# EAGLE design CAN-Adapter_3.2korr_0622 (EAGLE 6.1)
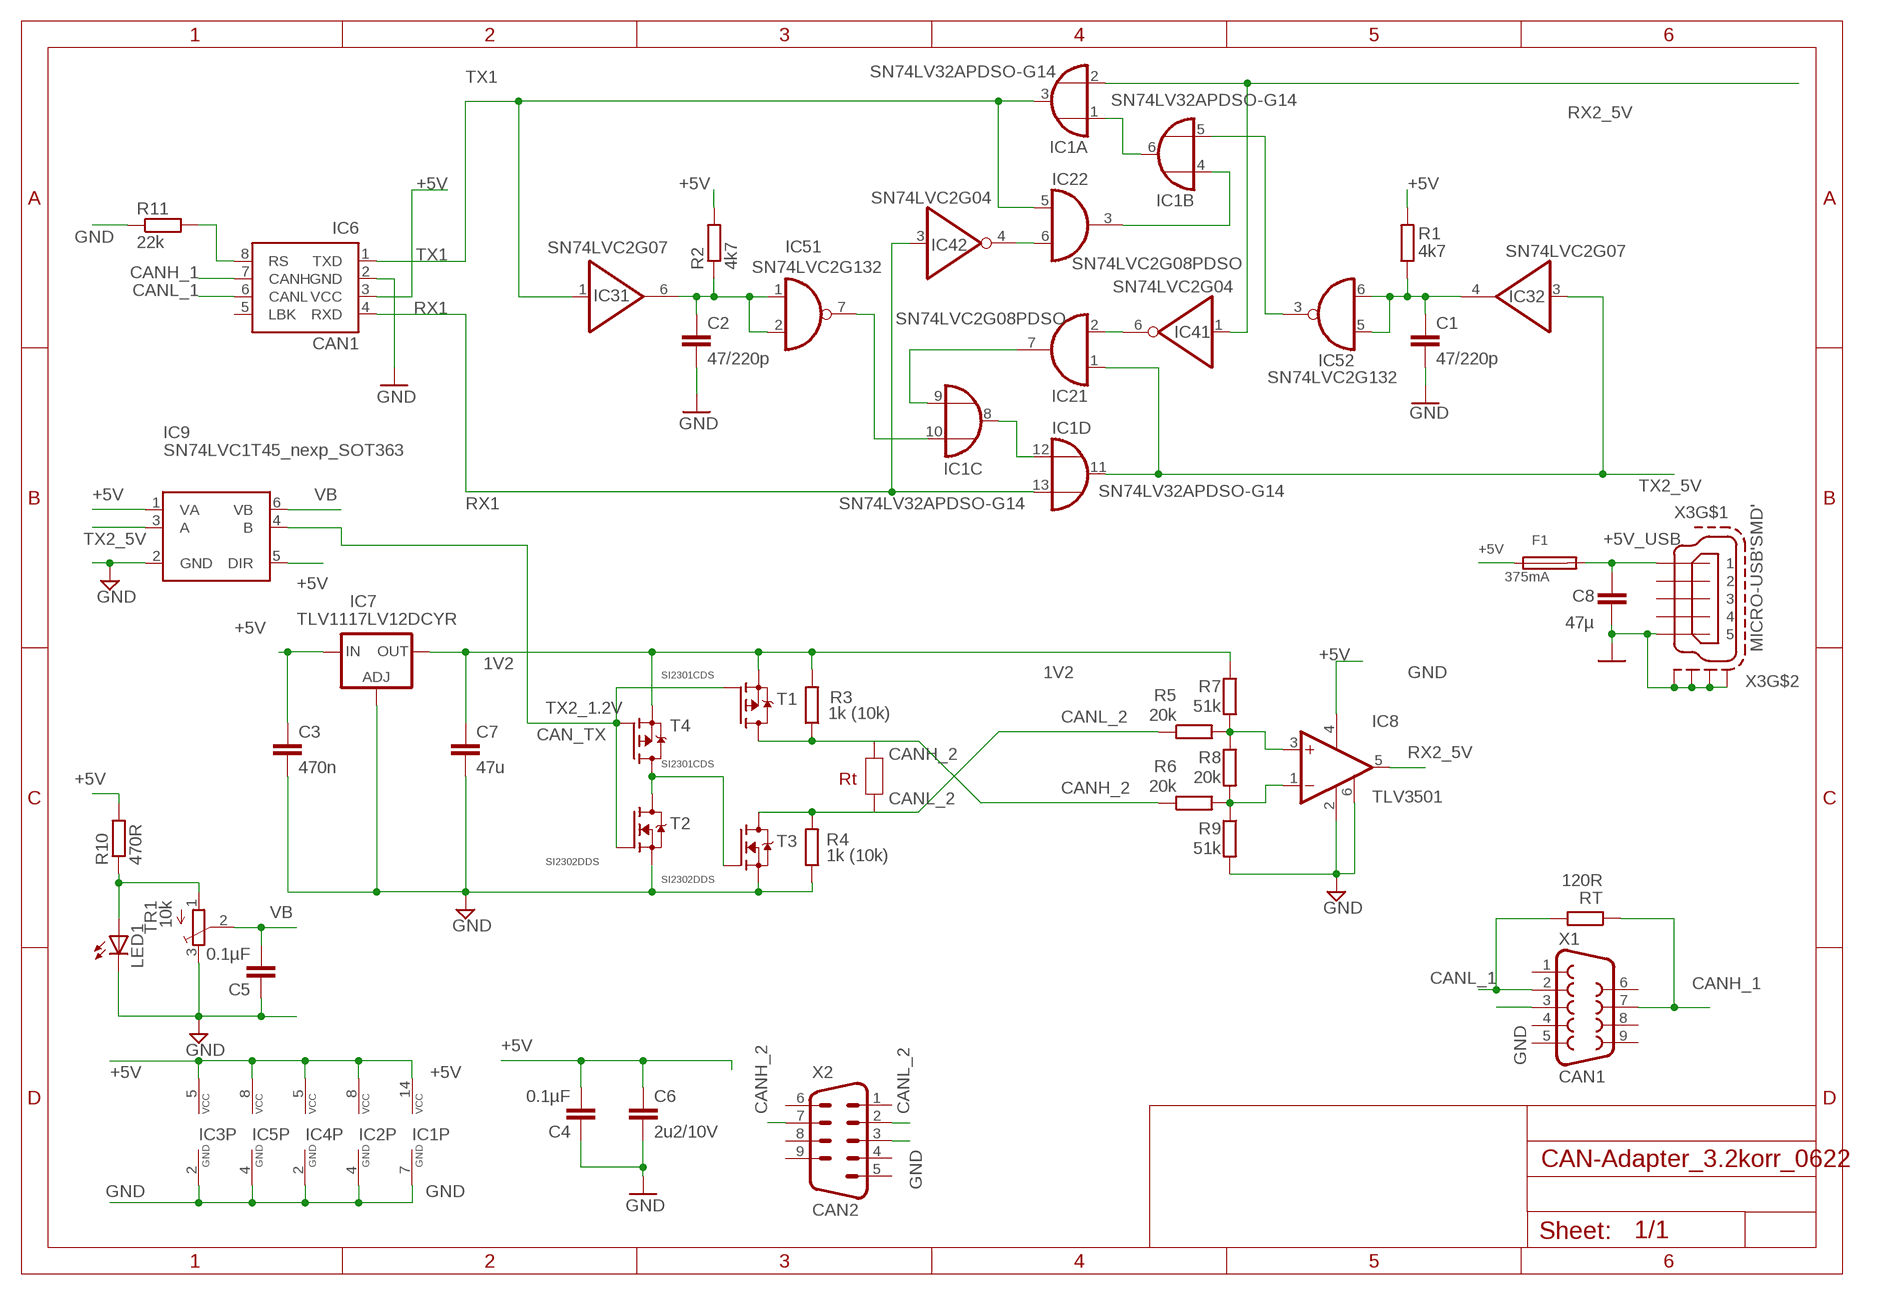
[diagram p0: schematic, sheet 1]

## Parts
C1  47/220p  C-EUC0603  [C0603]
C2  47/220p  C-EUC0603  [C0603]
C3  470n  C-EUC1206S  [C1206S]
C4  0.1µF  C-EUC0805  [C0805]
C5  0.1µF  C-EUC0805  [C0805]
C6  2u2/10V  C-EUC0805  [C0805]
C7  47u  C-EUC1206K  [C1206K]
C8  47µ  C-EUC1206K  [C1206K]
F1  375mA  SMD-FUSE1206  [1206]
IC1  SN74LV32APDSO-G14  [PW_R-PDSO-G14]
IC2  SN74LVC2G08PDSO  [R-PDSO-G08_DCT]
IC3  SN74LVC2G07  SN74LVC2G07DCK  [R-PDSO-G06]
IC4  SN74LVC2G04  SN74LVC2G04DCK  [R-PDSO-G06]
IC5  SN74LVC2G132  SN74LVC2G132DCU  [S-PDSO-G08_DCU]
IC6  CAN1  SN65233SO-08''  [SO-08]
IC7  TLV1117LV12DCYR  LD117AS12TR  [SOT223]
IC8  TLV3501  [SOT23-6]
IC9  SN74LVC1T45_nexp_SOT363  SN74AVCH1T45SOT363  [SOT363]
LED1  LED3MM  [LED3MM]
R1  4k7  R-EU_R0603  [R0603]
R2  4k7  R-EU_R0603  [R0603]
R3  1k (10k)  R-EU_R0603  [R0603]
R4  1k (10k)  R-EU_R0603  [R0603]
R5  20k  R-EU_R0603  [R0603]
R6  20k  R-EU_R0603  [R0603]
R7  51k  R-EU_R0603  [R0603]
R8  20k  R-EU_R0603  [R0603]
R9  51k  R-EU_R0603  [R0603]
R10  470R  R-EU_R0603  [R0603]
R11  22k  R-EU_R0603  [R0603]
RT  120R  R-EU_R0603  [R0603]
T1  SI2301CDS  SI2301CDS_PMOS  [SOT23]
T2  SI2302DDS  SI2302DDS_NMOS  [SOT23]
T3  SI2302DDS  SI2302DDS_NMOS  [SOT23]
T4  SI2301CDS  SI2301CDS_PMOS  [SOT23]
TR1  10k  TRIM_EU-TC33X-2  [TC33X-2]
X1  CAN1  F09D  [F09D]
X2  CAN2  M09D  [M09D]
X3  MICRO-USB'SMD'  [MICRO-USB_SMD]

## Nets
1V2: C7.1 IC7.4(OUT) R3.2 R7.1 T1.2(S) T4.2(S)
+5V: C3.1 C4.2 C6.1 F1.P$1 IC1.14(P:VCC) IC2.8(P:VCC) IC3.5(P:VCC) IC4.5(P:VCC) IC5.8(P:VCC) IC6.3(VCC) IC7.3(IN) IC8.4(V+) IC9.1(VA) IC9.5(DIR) R1.2 R2.2 R10.2
+5V_USB: C8.1 F1.P$2 X3.P$1
CANH_1: IC6.7(CANH) RT.1 X1.7
CANH_2: R3.1 R6.1 T1.3(D) X2.7
CANL_1: IC6.6(CANL) RT.2 X1.2
CANL_2: R4.2 R5.1 T3.3(D) X2.2
GND: C1.2 C2.2 C3.2 C4.1 C5.1 C6.2 C7.2 C8.2 IC1.7(P:GND) IC2.4(P:GND) IC3.2(P:GND) IC4.2(P:GND) IC5.4(P:GND) IC6.2(GND) IC7.1(ADJ) IC8.2(V-) IC8.6(SHDN) IC9.2(GND) LED1.K(C) R4.1 R9.2 R11.1 T2.2(S) T3.2(S) TR1.3(E) X1.3 X2.3 X3.P$5 X3.P$6(S1) X3.P$7(S2) X3.P$8(S3) X3.P$9(S4)
IC1,6: IC1.1(A:I0) IC1.6(B:O)
IC1,8: IC1.8(C:O) IC1.12(D:I0)
IC2,3: IC1.4(B:I0) IC2.3(2:Y)
IC2,7: IC1.9(C:I0) IC2.7(1:Y)
IC3,4: C1.1 IC3.4(2:Y) IC5.5(2:A) IC5.6(2:B) R1.1
IC3,6: C2.1 IC3.6(1:Y) IC5.1(1:A) IC5.2(1:B) R2.1
IC4,4: IC2.6(2:B) IC4.4(2:Y)
IC4,6: IC2.2(1:B) IC4.6(1:Y)
IC5,3: IC1.5(B:I1) IC5.3(2:Y)
IC5,7: IC1.10(C:I1) IC5.7(1:Y)
N$9: T2.3(D) T3.1(G) T4.3(D)
N$12: LED1.A R10.1 TR1.1(A)
N$18: IC6.8(RS) R11.2
N$23: IC8.3(+IN) R5.2 R7.2 R8.1
N$24: IC8.1(-IN) R6.2 R8.2 R9.1
RX1: IC1.13(D:I1) IC4.3(2:A) IC6.4(RXD)
RX2_5V: IC1.2(A:I1) IC4.1(1:A) IC8.5(OUT)
TX1: IC1.3(A:O) IC2.5(2:A) IC3.1(1:A) IC6.1(TXD)
TX2_1.2V: IC9.4(B) T1.1(G) T2.1(G) T4.1(G)
TX2_5V: IC1.11(D:O) IC2.1(1:A) IC3.3(2:A) IC9.3(A)
VB: C5.2 IC9.6(VB) TR1.2(S)
Unconnected: IC6.5(LBK) X1.1 X1.4 X1.5 X1.6 X1.8 X1.9 X2.1 X2.4 X2.5 X2.6 X2.8 X2.9 X3.P$2 X3.P$3 X3.P$4

## Notes on the sheet
- SN74LVC2G08PDSO
- SN74LVC2G08PDSO
- CAN_TX
- Rt

## Library data of the parts
C1-C8 = rcl:C-EU: CAPACITOR, European symbol
F1 = fuse:SMD-FUSE
IC1 = texas:SN74LV32A: SN74LV32A Quadruple 2-Input Positive-Or Gates
IC2 = texas:SN74LVC2G08: SN74LVC2G08 Dual 2-Input Positive-AND Gate
IC3 = texas:SN74LVC2G07: SN74LVC2G07 Dual Buffer and Driver With Open-Drain Outputs
IC4 = texas:SN74LVC2G04: SN74LVC2G04 Dual Inverter Gate
IC5 = texas:SN74LVC2G132: Dual 2-Input NAND Gate With Schmitt-Trigger Inputs
IC6 = texas:SN65233: 3,3V CAN Transeiver
IC7 = v-reg:LD117A?*: Low drop fixed and adjustable positive voltage regulators 1 A Source: http://www.st.com/stonline/products/literature/ds/7194/ld1117axx.pdf
IC8 = texas:TLV3501
IC9 = texas:SN74AVCH1T45
LED1 = led:LED: LED OSRAM: - CHIPLED LG R971, LG N971, LY N971, LG Q971, LY Q971, LO R971, LY R971 LH N974, LH R974 LS Q976, LO Q976, LY Q976 LO Q996 - Hyper CHIPLED LW Q18S LB Q993, LB Q99A, LB R99A - SideLED LS A670, LO A670, LY A670, LG A670, LP A670 LB A673, LV A673, LT A673, LW A673 LH A674 LY A675 LS A676, LA A676, LO A676, LY A676, LW A676 LS A679, LY A679, LG A679 - Hyper Micro SIDELED® LS Y876, LA Y876, LO Y876, LY Y876 LT Y87S - SmartLED LW L88C, LW L88S LB L89C, LB L89S, LG L890 LS L89K, LO L89K, LY L89K LS L896, LA L896, LO L896, LY L896 - TOPLED LS T670, LO T670, LY T670, LG T670, LP T670 LSG T670, LSP T670, LSY T670, LOP T670, LYG T670 LG T671, LOG T671, LSG T671 LB T673, LV T673, LT T673, LW T673 LH T674 LS T676, LA T676, LO T676, LY T676, LB T676, LH T676, LSB T676, LW T676 LB T67C, LV T67C, LT T67C, LS T67K, LO T67K, LY T67K, LW E67C LS E67B, LA E67B, LO E67B, LY E67B, LB E67C, LV E67C, LT E67C LW T67C LS T679, LY T679, LG T679 LS T770, LO T770, LY T770, LG T770, LP T770 LB T773, LV T773, LT T773, LW T773 LH T774 LS E675, LA E675, LY E675, LS T675 LS T776, LA T776, LO T776, LY T776, LB T776 LHGB T686 LT T68C, LB T68C - Hyper Mini TOPLED® LB M676 - Mini TOPLED Santana® LG M470 LS M47K, LO M47K, LY M47K Source: http://www.osram.convergy.de LUXEON: - LUMILED® LXK2-PW12-R00, LXK2-PW12-S00, LXK2-PW14-U00, LXK2-PW14-V00 LXK2-PM12-R00, LXK2-PM12-S00, LXK2-PM14-U00 LXK2-PE12-Q00, LXK2-PE12-R00, LXK2-PE12-S00, LXK2-PE14-T00, LXK2-PE14-U00 LXK2-PB12-K00, LXK2-PB12-L00, LXK2-PB12-M00, LXK2-PB14-N00, LXK2-PB14-P00, LXK2-PB14-Q00 LXK2-PR12-L00, LXK2-PR12-M00, LXK2-PR14-Q00, LXK2-PR14-R00 LXK2-PD12-Q00, LXK2-PD12-R00, LXK2-PD12-S00 LXK2-PH12-R00, LXK2-PH12-S00 LXK2-PL12-P00, LXK2-PL12-Q00, LXK2-PL12-R00 Source: www.luxeon.com KINGBRIGHT: KA-3528ASYC Source: www.kingbright.com
R1-R11 RT = rcl:R-EU_: RESISTOR, European symbol
T1 T4 = transistor-fet:SI2301CDS_PMOS: P-MOSFET low Uth
T2 T3 = transistor-fet:SI2302DDS_NMOS: N-MOSFET, low Uth
TR1 = pot:TRIM_EU-: POTENTIOMETER
X1 = con-subd:F09: SUB-D; OC_FARNELL: unknown; OC_NEWARK: unknown
X2 = con-subd:M09: SUB-D; OC_FARNELL: unknown; OC_NEWARK: unknown
X3 = Connectors:MICRO-USB

## Board
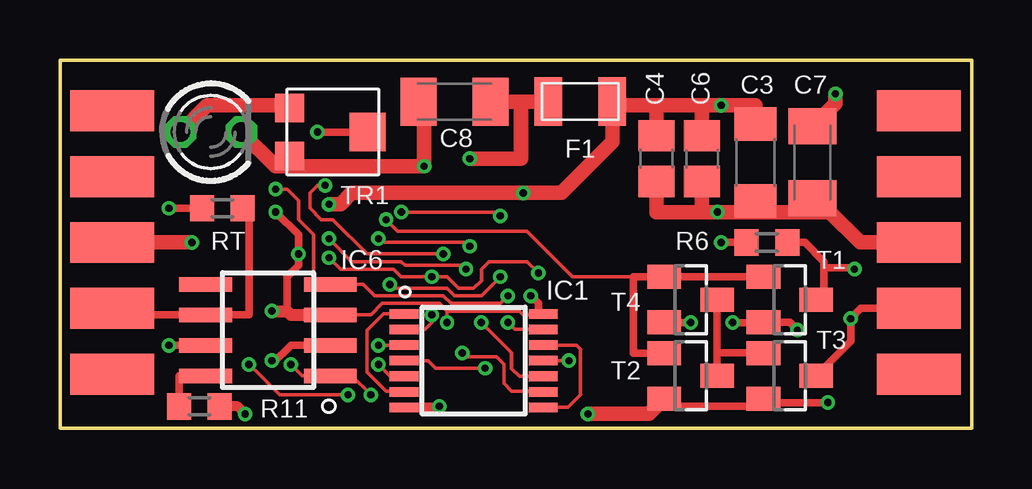
[diagram p1: board, top side]
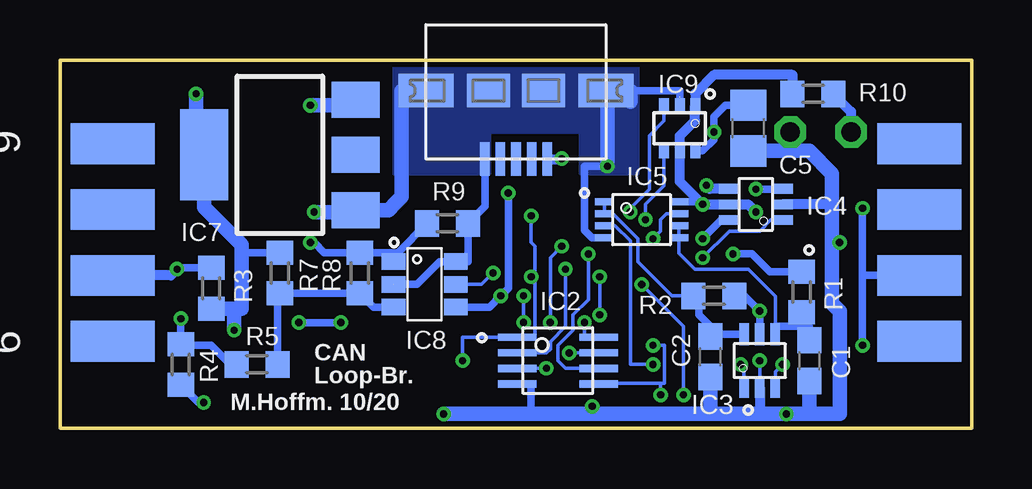
[diagram p2: board, bottom side, seen from below]

Size 38 x 15.34 mm. Coordinates in mm from the lower left corner, seen from the top.
Outline: 0,15.34 0,0 38,0 38,15.34 0,15.34
Copper layers (1*16): Top 0.035mm / dielectric 1.5mm / Bottom 0.035mm
Design rules: minimum track width 0.1mm, minimum drill 0.2mm, track to track 0.1mm, track to pad 0.1mm, pad to pad 0.1mm, via to via 0.1mm, smd to smd 0.1mm, copper to edge 0.2mm, drill to drill 0.21mm, minimum pad ring 0.25mm, minimum via ring 0.15mm, stop-mask expansion 0mil, vias tented up to drill 0mil, thermal gap 10mil

### Footprints (pad centres in the part's own frame; a part is rotated, then mirrored left to right if it is on the bottom)
C0603 = smd 1.1 x 1: 1 -0.85,0; 2 0.85,0
C1206S = smd 1.397 x 1.753: 1 -1.6,0; 2 1.6,0
C0805 = smd 1.3 x 1.5: 1 -0.95,0; 2 0.95,0
C1206K = smd 1.5 x 2: 1 -1.5,0; 2 1.5,0
1206 = smd 1.143 x 2.032: P$1 -1.333,0; P$2 1.333,0
PW_R-PDSO-G14 = smd 0.4 x 1.2: 1 -1.95,-2.9; 2 -1.3,-2.9; 3 -0.65,-2.9; 4 0,-2.9; 5 0.65,-2.9; 6 1.3,-2.9; 7 1.95,-2.9; 8 1.95,2.9; 9 1.3,2.9; 10 0.65,2.9; 11 0,2.9; 12 -0.65,2.9; 13 -1.3,2.9; 14 -1.95,2.9
R-PDSO-G08_DCT = smd 0.3 x 1.6: 1 -0.975,-1.7; 2 -0.325,-1.7; 3 0.325,-1.7; 4 0.975,-1.7; 5 0.975,1.7; 6 0.325,1.7; 7 -0.325,1.7; 8 -0.975,1.7
R-PDSO-G06 = smd 0.4 x 0.9: 1 -0.65,-1.1; 2 0,-1.1; 3 0.65,-1.1; 4 0.65,1.1; 5 0,1.1; 6 -0.65,1.1
S-PDSO-G08_DCU = smd 0.3 x 0.8: 1 -0.75,-1.55; 2 -0.25,-1.55; 3 0.25,-1.55; 4 0.75,-1.55; 5 0.75,1.55; 6 0.25,1.55; 7 -0.25,1.55; 8 -0.75,1.55
SO-08 = smd 0.6 x 2.2: 1 -1.905,-2.6; 2 -0.635,-2.6; 3 0.635,-2.6; 4 1.905,-2.6; 5 1.905,2.6; 6 0.635,2.6; 7 -0.635,2.6; 8 -1.905,2.6
SOT223 = smd 1.5 x 2: 1 -2.3,-3.15; 2 0,-3.15; 3 2.3,-3.15 | smd 3.8 x 2: 4 0,3.15
SOT23-6 = smd 0.69 x 0.99: 1 -0.95,-1.29; 2 0,-1.29; 3 0.95,-1.29; 4 0.95,1.3; 5 0.003,1.3; 6 -0.95,1.3
SOT363 = smd 0.42 x 0.6: 1 -0.65,-0.95; 2 0,-0.95; 3 0.65,-0.95; 4 0.65,0.95; 5 0,0.95; 6 -0.65,0.95
LED3MM = drill 0.813 octagon: A -1.27,0; K 1.27,0
R0603 = smd 1 x 1.1: 1 -0.85,0; 2 0.85,0
SOT23 = smd 1 x 1.4: 1 -0.95,-1.1; 2 0.95,-1.1; 3 0,1.1
TC33X-2 = smd 1.2 x 1.2: 1 -1,-1.8; 3 1,-1.8 | smd 1.6 x 1.5: 2 0,1.45
F09D = smd 1.7 x 3.5: 1 -5.486,-6.045; 2 -2.743,-6.045; 3 0,-6.045; 4 2.743,-6.045; 5 5.486,-6.045 | smd 1.7 x 3.5 bottom: 6 -4.115,-6.045; 7 -1.372,-6.045; 8 1.372,-6.045; 9 4.115,-6.045
M09D = smd 1.7 x 3.5: 1 5.486,-6.045; 2 2.743,-6.045; 3 0,-6.045; 4 -2.743,-6.045; 5 -5.486,-6.045 | smd 1.7 x 3.5 bottom: 6 4.115,-6.045; 7 1.372,-6.045; 8 -1.372,-6.045; 9 -4.115,-6.045
MICRO-USB_SMD = smd 0.4 x 1.4: P$1 -1.3,4.3; P$2 -0.65,4.3; P$3 0,4.3; P$4 0.65,4.3; P$5 1.3,4.3 | smd 2.3 x 1.4: P$6 -3.75,1.45; P$9 3.75,1.45 | smd 1.8 x 1.4: P$7 -1.15,1.45; P$8 1.15,1.45

### Placement (x,y rotation side)
C1  6.77,2.82 270 bottom
C2  10.89,2.98 270 bottom
C3  28.99,11.07 270 top
C4  24.86,11.23 90 top
C5  9.31,12.5 90 bottom
C6  26.77,11.23 270 top
C7  31.37,11.07 270 top
C8  16.45,13.61 180 top
F1  21.69,13.61 180 top
IC1  17.25,2.82 270 top
IC2  17.25,2.82 270 bottom
IC3  8.83,2.82 0 bottom
IC4  8.99,9.33 90 bottom
IC5  13.75,8.69 270 bottom
IC6  8.67,4.09 90 top
IC7  28.83,11.39 90 bottom
IC8  22.8,5.99 270 bottom
IC9  12.17,12.5 180 bottom
LED1  6.29,12.34 0 top
R1  7.08,5.67 90 bottom
R2  10.74,5.52 0 bottom
R3  31.69,5.83 270 bottom
R4  32.96,2.66 90 bottom
R5  29.79,2.66 0 bottom
R6  29.47,7.74 180 top
R7  28.83,6.47 270 bottom
R8  25.5,6.47 90 bottom
R9  21.85,8.53 0 bottom
R10  6.61,13.93 180 bottom
R11  5.82,0.91 180 top
RT  6.77,9.17 0 top
T1  30.42,5.36 270 top
T2  26.29,2.18 270 top
T3  30.42,2.18 270 top
T4  26.29,5.36 270 top
TR1  11.37,12.34 270 top
X1  -3.87,7.74 90 top
X2  41.85,7.74 270 top
X3  18.99,15.52 180 bottom

### Tracks (layer width: path | path; a pad name or v marks a point on that pad's centre or on a via)
1V2  (via drill 0.3)
  Top 0.305: v28.04,4.4 T1.2 30.42,4.41 v30.74,4.09 | T4.2 v26.29,4.4
  Top 0.61: 32.33,13.68 v32.33,13.93 32.33,13.52 C7.1
  Bottom 0.305: v26.29,4.4 v28.04,4.4 | 30.42,7.32 R7.1 | R3.2 31.64,4.98
  Bottom 0.61: v32.33,13.93 32.33,11.86 32.01,11.86 32.01,11.68 31.69,11.68 IC7.4 31.98,9.2 30.42,7.63 30.42,7.32 30.42,4.98 30.74,4.98 | 31.64,4.98 30.74,4.98 | v30.74,4.09 30.74,4.98
+5V  (via drill 0.3)
  Top 0.152: 16.13,4.88 19.15,4.88 19.31,4.72 19.94,4.72 20.15,4.72 IC1.14 | 16.13,4.88 15.82,5.2 13.44,5.2 12.96,4.72 IC6.3 | 16.13,4.88 v16.13,4.4
  Top 0.305: v19.63,5.51 19.94,5.2 19.94,4.72 | v8.99,9.01 9.94,8.05 v9.94,7.26 9.94,6.78 9.47,6.31 9.47,4.88
  Top 0.508: v8.83,4.88 9.47,4.88 9.63,4.72 IC6.3
  Top 0.61: v11.21,9.32 11.69,9.32 12.17,9.8 v19.31,9.8 20.9,9.8 23.02,11.93 F1.P$1 23.02,13.45 24.87,13.45 | C3.1 28.99,13.45 v27.56,13.45 26.77,13.45 | C6.1 26.77,13.45 | C4.2 24.87,13.45 | 24.87,13.45 26.77,13.45
  Bottom 0.152: IC2.8 16.13,3.79 v16.13,4.4
  Bottom 0.305: R2.2 9.47,5.51 v8.83,4.88 IC3.5 | 11.53,13.43 IC9.1 | v19.31,9.8 19.31,5.83 v19.63,5.51 20.1,5.04 IC8.4 | 12.17,9.44 IC5.8 11.33,9.44 v11.21,9.32 | v9.94,7.26 9.15,7.26 8.41,6.52 R1.2
  Bottom 0.406: 11.53,13.43 11.53,12.82 12.17,12.18 IC9.5 12.17,10.28 v11.21,9.32 IC4.5 9.31,9.32 v8.99,9.01 | IC9.1 11.52,13.94 10.74,14.72 7.46,14.72 R10.2
  Bottom 0.61: IC7.3 25.68,13.61 25.84,13.45 v27.56,13.45
+5V_USB  (via drill 0.3)
  Top 0.406: 19.22,13.54 19.15,13.61
  Top 0.61: v17.09,11.23 19.22,11.23 19.22,13.54 | 19.15,13.61 C8.1 F1.P$2
  Bottom 0.406: X3.P$1 17.09,11.22 v17.09,11.23
CANH_1  (via drill 0.3)
  Top 0.305: IC6.7 v4.55,3.45 | RT.1 v4.55,9.17
  Bottom 0.305: 4.55,6.37 X1.7 | v4.55,3.45 4.55,6.37 | 4.55,6.37 v4.55,9.17
CANH_2  (via drill 0.3)
  Top 0.305: 30.48,7.58 R6.1 31.06,7.74 31.85,6.94 | 31.84,6.94 31.85,6.94 | 31.85,6.94 31.85,6.69 | 31.85,6.69 31.85,5.36 T1.3 | 31.85,6.69 33.05,6.69 v33.12,6.63
  Bottom 0.305: 35.81,6.31 X2.7 | R3.1 33.06,6.68 v33.12,6.63
  Bottom 0.406: v33.12,6.63 33.38,6.37 X2.7
  Bottom 0.508: X2.7 35.82,6.37
CANL_1
  Top 0.152: X1.2 2.18,5.2
  Top 0.305: X1.2 2.18,4.72 IC6.6 7.88,4.72 7.88,9.17 RT.2
CANL_2  (via drill 0.3)
  Top 0.305: T3.3 32.96,3.62 v32.96,4.56 33.39,4.99 X2.2
  Bottom 0.305: v32.96,4.56 R4.2 32.96,3.45 31.69,3.45 30.9,2.66 R5.1
GND  (via drill 0.3)
  Top 0.152: IC1.7 14.39,0.91
  Top 0.305: X2.3 35.34,7.74 | v8.83,2.82 8.83,2.66 9.63,3.45 IC6.2 | 6.67,0.75 R11.1 | T2.2 25.19,0.91 29.32,0.91 T3.2 29.32,1.07 v32.01,1.07
  Top 0.406: v7.72,0.59 7.4,0.91 R11.1 | IC1.7 15.82,0.87 v15.82,0.91
  Top 0.61: v22.01,0.59 24.55,0.59 T2.2 | 9.57,10.91 v15.18,10.91 15.18,13.61 C8.2 | 26.77,8.99 27.41,8.99 v27.41,9.01 28.99,9.01 | 26.77,8.99 C6.2 | X2.3 33.37,7.74 32.1,9.01 31.37,9.01 | 9.57,10.91 TR1.3 | 9.57,10.91 8.99,10.91 LED1.K | 26.77,8.99 24.87,8.99 C4.1 | C3.2 28.99,9.01 | C7.2 31.37,9.01 | 31.37,9.01 28.99,9.01 | X1.3 v5.5,7.74
  Bottom 0.152: IC2.4 18.99,1.84 | v8.83,2.82 IC3.2 | 23.97,9.38 23.99,9.4
  Bottom 0.305: IC5.4 15.82,7.94 16.13,8.26 16.13,10.91 v15.18,10.91 | IC2.4 18.36,1.84 18.36,0.59 | IC9.2 12.17,14.07 14.71,14.07 | IC8.2 23.12,5.99 22.17,6.94 IC8.6 21,6.94 R9.2 20.29,9.24 X3.P$5 | v32.01,1.07 32.22,1.07 R4.1
  Bottom 0.406: 5.82,9.32 IC4.2 | IC3.2 8.83,0.59 | v15.82,0.91 15.82,0.59
  Bottom 0.61: 5.82,7.74 5.82,9.32 5.82,10.59 6.77,11.55 7.56,11.55 | v5.5,7.74 5.82,7.74 | 5.82,7.74 5.82,5.2 5.5,4.88 5.5,0.59 6.77,0.59 | 6.77,0.59 v7.72,0.59 8.83,0.59 10.9,0.59 | C1.2 6.77,0.59 | 10.9,0.59 15.82,0.59 18.36,0.59 v22.01,0.59 | 10.9,0.59 C2.2 10.9,1.86 | 14.23,13.61 14.23,14.07 14.71,14.07 X3.P$6 15.18,14.07 v15.18,10.91 | 22.64,13.97 X3.P$9 23.75,14.07 23.75,9.64 23.99,9.4 24.31,9.09 IC7.1 25.68,9.01 v27.41,9.01 | C5.1 7.56,11.55 | 7.56,11.55 LED1.K
  pour Bottom (no thermals): 13.91,15.04 24.07,15.04 24.07,10.6 20.1,10.6 20.1,12.34 16.29,12.34 16.29,10.6 13.91,10.6
IC1,6
  Top 0.152: IC1.6 14.35,1.55 13.59,1.55 12.8,2.34 12.8,4.09 13.48,4.77 IC1.1 14.23,4.77
IC1,8
  Top 0.152: IC1.12 20.13,3.45 21.53,3.45 21.69,3.29 21.69,1.39 21.17,0.87 IC1.8
IC2,3  (via drill 0.3)
  Top 0.152: v17.72,2.5 15.66,2.5 15.34,2.82 IC1.4
  Bottom 0.152: IC2.3 v17.72,2.5
IC2,7  (via drill 0.3)
  Top 0.152: 20.15,1.55 IC1.9 20.12,1.55 18.83,1.55 18.52,1.86 18.52,2.66 18.2,2.97 16.93,2.97 v16.77,3.13
  Bottom 0.152: v16.77,3.13 16.76,3.14 IC2.7
IC3,4
  Bottom 0.152: IC5.6 IC5.5 12.2,7.3 11.53,6.63 9.31,6.63 8.18,5.5 8.18,4.24
  Bottom 0.305: C1.1 6.77,4.24 7.09,4.24 | 7.09,4.24 R1.1 | IC3.4 8.18,4.24 7.09,4.24
IC3,6
  Bottom 0.152: IC5.1 IC5.2 14.96,8.94 13.91,7.9 13.91,6.94 12.48,5.51 R2.1
  Bottom 0.305: IC3.6 10.9,3.92 C2.1 10.9,4.24 11.37,4.72 11.37,5.51 R2.1
IC4,4  (via drill 0.3)
  Top 0.152: v15.98,7.26 12.8,7.26 11.37,8.69 10.9,8.69 10.42,9.17 10.42,9.8 10.74,10.12 v11.05,10.12
  Bottom 0.152: IC2.6 16.92,2.49 17.25,2.82 17.25,3.45 16.61,4.09 16.61,4.72 15.98,5.36 v15.98,7.26
  Bottom 0.305: 10.11,9.96 IC4.4
  Bottom 0.406: IC4.4 10.91,9.97 v11.05,10.12
IC4,6  (via drill 0.3)
  Top 0.152: v11.21,7.9 12.17,6.94 14.23,6.94 14.39,6.78 16.77,6.78 v16.93,6.63
  Bottom 0.152: IC2.2 17.71,3.14 17.56,3.29 17.56,3.61 16.93,4.24 v16.93,6.63
  Bottom 0.305: IC4.6 10.43,8.67 v11.21,7.9
IC5,3  (via drill 0.3)
  Top 0.152: IC1.5 13.77,2.17 v13.28,2.66
  Bottom 0.152: IC5.3 14.86,8.44 14.23,7.8 14.23,2.66 v13.28,2.66
IC5,7  (via drill 0.3)
  Top 0.152: IC1.10 19.15,2.17 18.83,2.48 18.83,3.13 v17.56,4.4 | v17.09,7.58 16.93,7.74 13.44,7.74 v13.28,7.9
  Bottom 0.152: 12.26,8.94 IC5.7 12.71,8.94 12.96,8.69 12.96,8.21 v13.28,7.9 | v17.56,4.4 17.56,7.1 v17.09,7.58
N$9
  Top 0.152: 27.41,2.17 arc90 T2.3
  Top 0.305: T4.3 27.39,3.13 | 27.39,3.13 T2.3 | T3.1 27.39,3.13
N$12
  Top 0.508: TR1.1 9.57,13.45
  Top 0.61: 9.57,13.45 6.13,13.45 LED1.A
  Bottom 0.406: 5.12,12.44 LED1.A 5.02,13.19 R10.1
N$18
  Top 0.305: R11.2 4.97,2.18 IC6.8
N$23
  Bottom 0.305: IC8.3 24.92,5.04 R8.1 R7.2 28.94,5.62 R5.2
N$24  (via drill 0.3)
  Top 0.305: v27.56,7.74 R6.2
  Bottom 0.305: 24.23,7.32 R8.2 26.99,7.32 27.41,7.74 v27.56,7.74 | 24.23,7.32 23.91,7.32 R9.1 | IC8.1 24.09,7.18 24.23,7.32
RX1  (via drill 0.3)
  Top 0.152: v8.99,9.96 9.47,9.96 9.94,9.48 9.94,8.69 10.58,8.05 10.58,6.15 10.74,5.99 IC6.4 12.64,5.99 13.12,5.51 15.98,5.51 16.29,5.2 18.36,5.2 v18.67,5.51 | IC1.13 18.96,4.12 v18.67,4.4
  Bottom 0.152: v18.67,4.4 v18.67,5.51
  Bottom 0.305: IC4.3 7.91,9.96 v8.99,9.96
RX2_5V  (via drill 0.3)
  Top 0.152: IC1.2 15.21,4.12 15.5,4.4 v15.5,4.72 | v11.21,7.1 11.69,6.63 13.91,6.63 14.23,6.31 v15.5,6.31 16.13,6.31 16.61,5.83 17.25,5.83 17.56,6.15 17.56,6.63 17.88,6.94 19.47,6.94 v19.94,6.47
  Bottom 0.152: v15.5,4.72 v15.5,6.31 | v19.94,6.47 20.42,5.99 IC8.5 | v11.21,7.1 10.1,8.21 8.83,8.21 8.37,8.67 IC4.1
TX1  (via drill 0.3)
  Top 0.152: v13.28,3.45 13.28,3.47 IC1.3 | v12.96,1.39 12.17,2.18 IC6.1 10.1,2.18 v9.63,2.66
  Bottom 0.152: IC2.5 15.55,1.86 12.96,1.86 | 12.96,1.86 12.8,1.86 12.8,3.45 v13.28,3.45 | 12.96,1.86 v12.96,1.39 | IC3.1 9.48,2.51 v9.63,2.66
TX2_1.2V  (via drill 0.3)
  Top 0.152: v13.59,8.69 14.07,8.21 19.47,8.21 21.37,6.31 23.91,6.31 | T4.1 arc-90 T4.1
  Top 0.305: T4.1 23.91,6.31 23.91,3.13 T2.1 | T4.1 T1.1
  Bottom 0.152: v13.59,8.69 13.59,9.32 12.82,10.1 IC9.4
TX2_5V  (via drill 0.3)
  Top 0.152: v18.36,6.31 17.56,5.51 16.45,5.51 16.13,5.83 13.91,5.83 v13.75,5.99 | v7.88,2.66 9.15,1.39 v12.01,1.39 | IC1.11 v21.21,2.82 | v18.36,8.85 18.2,9.01 v14.23,9.01
  Bottom 0.152: 18.2,6.31 18.2,7.58 18.36,7.74 v18.36,8.85 | v18.36,6.31 18.2,6.31 | 18.2,6.31 18.2,3.79 IC2.1 21.21,3.79 v21.21,2.82 | v12.01,1.39 12.01,4.24 v13.75,5.99 | v7.88,2.66 8.18,2.35 IC3.3 | 12.83,13.44 IC9.3 12.82,12.8 13.44,12.18 13.44,9.96 14.23,9.17 v14.23,9.01
VB  (via drill 0.3)
  Top 0.305: TR1.2 v10.74,12.34
  Bottom 0.305: IC9.6 11.21,11.55 10.74,12.02 v10.74,12.34 10.74,12.98 10.26,13.45 C5.2

### Text on the board
bNames: CAN | Loop-Br. | M.Hoffm. 10/20